# EAGLE schematic BaoFengTRRSAdapter-Example (EAGLE 6.5.0)
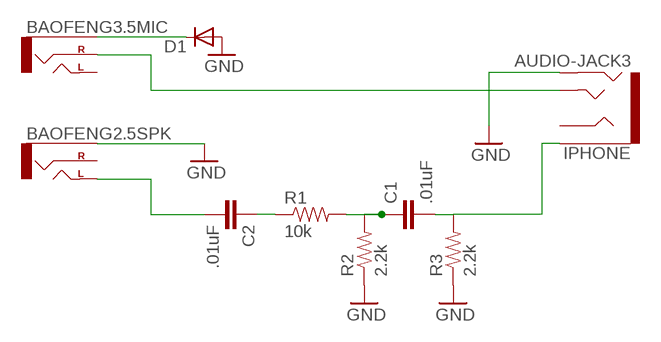
[diagram p0: schematic, sheet 1]

## Parts
BAOFENG2.5SPK  AUDIO-JACK2.5MM  [STEREOJACK2.5MM_STEREOJACK2.5MM]
BAOFENG3.5MIC  AUDIO-JACKHOLESONLY  [STEREOJACK2.5MM_SPECIAL_HOLES-ONLY]
C1  .01uF  CAP0603-CAP  [0603-CAP]
C2  .01uF  CAP0603-CAP  [0603-CAP]
D1  DIODE1N4148  [DIODE-1N4148]
IPHONE  AUDIO-JACK3  [AUDIO-JACK-TRRS-SMD]
R1  10k  RESISTOR0603-RES  [0603-RES]
R2  2.2k  RESISTOR0603-RES  [0603-RES]
R3  2.2k  RESISTOR0603-RES  [0603-RES]

## Nets
BAOFENGMIC+: BAOFENG3.5MIC.TIP(RIGHT) IPHONE.TIP
BAOFENGMIC-: BAOFENG3.5MIC.RING1(SLEEVE) D1.C
BAOFENGSPK+: BAOFENG2.5SPK.SHIELD(LEFT) C2.2
GND: BAOFENG2.5SPK.RING1(SLEEVE) D1.A IPHONE.RING2 R2.1 R3.1
N$3: C1.1 R1.2 R2.2
N$4: C1.2 IPHONE.EARTH R3.2
N$6: C2.1 R1.1
Unconnected: BAOFENG2.5SPK.TIP(RIGHT) BAOFENG3.5MIC.SHIELD(LEFT) IPHONE.RING1

## Library data of the parts
BAOFENG2.5SPK BAOFENG3.5MIC = SparkFun-Connectors:AUDIO-JACK: 3.5mm Audio Jack Simple 3.5mm common PCB mount audio jack. SKU: PRT-08032
C1 C2 = SparkFun-Passives:CAP: Capacitor Standard 0603 ceramic capacitor, and 0.1" leaded capacitor.
D1 = SparkFun-DiscreteSemi:DIODE: Diode These are standard reverse protection diodes and small signal diodes. SMA package can handle up to about 1A. SOD-323 can handle about 200mA. What the SOD-323 package when ordering, there are some mfgs out there that are 5-pin packages.
IPHONE = SparkFun-Connectors:AUDIO-JACK3: Audio jack - 3.5mm TRRS variety - two rings.
R1-R3 = SparkFun-Passives:RESISTOR: Resistor Basic schematic elements and footprints for 0603, 1206, and PTH resistors.